# Altium schematic sheet [6] RGBLED.SchDoc: =DocumentName
size A3; ENG_APP_DATE: --/--/--; DSN_APP_DATE: --/--/--; CHK_APP_DATE: --/--/--; Organization: ORGANIZATION; Address1: R. Aprígio Veloso, 882, Universitário; Address2: Campina Grande - PB; Address3: 58429-900; DocumentNumber: 6; Revision: -; SheetNumber: 6; SheetTotal: 9; ENG_DATE: --/--/--; DSN_DATE: --/--/--; CHK_DATE: --/--/--; SCH_SCALE: 1:1
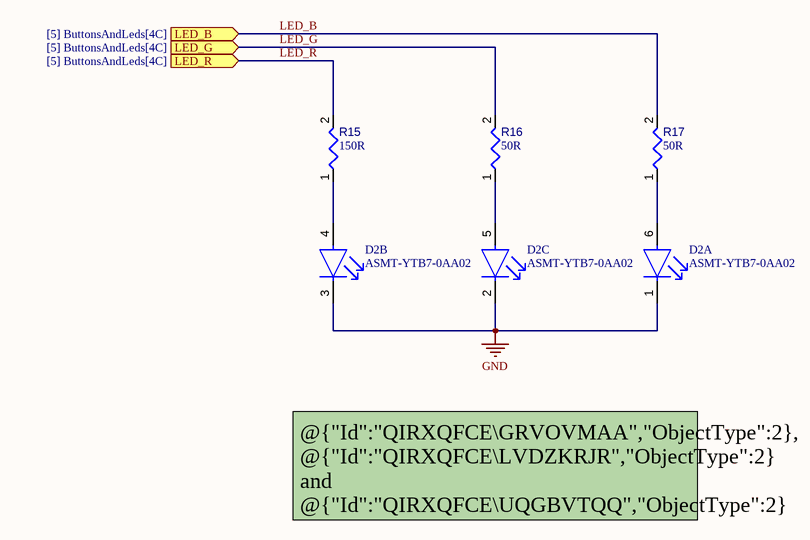
[diagram p0: [6] RGBLED.SchDoc]

## Parts
D2  ASMT-YTB7-0AA02  [FP-PLCC-6-MFG]  (parts A,B,C of 3)
R15  value 150R  [RESC0603(1608)_L]  (hidden comment: CRCW0603150RFKEA)
R16  value 50R  [RESC0603(1608)_L]  (hidden comment: CRCW060350R0FKEA)
R17  value 50R  [RESC0603(1608)_L]  (hidden comment: CRCW060350R0FKEA)

## Ports
LED_B (in, see [5] ButtonsAndLeds[4C]), LED_G (in, see [5] ButtonsAndLeds[4C]), LED_R (in, see [5] ButtonsAndLeds[4C])

## Nets
GND: D2.1(Cathode(Blue)) D2.2(Cathode(Green)) D2.3(Cathode(Red))
LED_B: R17.2 ; port LED_B
LED_G: R16.2 ; port LED_G
LED_R: R15.2 ; port LED_R
NetD2_4: D2.4(Anode(Red)) R15.1
NetD2_5: D2.5(Anode(Green)) R16.1
NetD2_6: D2.6(Anode(Blue)) R17.1

## Notes on the sheet
- @{"Id":"QIRXQFCE\GRVOVMAA","ObjectType":2}, @{"Id":"QIRXQFCE\LVDZKRJR","ObjectType":2} and @{"Id":"QIRXQFCE\UQGBVTQQ","ObjectType":2} calculated based on voltage drops for each LED for a same current amount of 10mA.
- REVISION
- DESCRIPTION
- DATE
- APPROVED
- ADDRESS
- PROJECT
- VERSION
- TITLE
- A3
- SIZE
- SCALE
- DOCUMENT NAME:
- DOCUMENT REVISION:
- OF
- SHEET:
- PROJECT REVISION:

## Library data of the parts
D2 = CMP-007-00036-1: LED Tri-Color Blue/Green/Red 469nm/529nm/623nm Chip LED 6-Pin PLCC T/R; Forward Voltage: 3.1V; Test Current: 20mA; Number of LEDs: 3; Lens Transparency: Diffused; Luminous Intensity: 384mcd; Viewing Angle: 120°; Color: Blue,Green,Red; Reverse Voltage: 4V; Dominant Wavelength: 469nm; Lens Style: Flat,Square,Diffused,Rectangular; Lens Size: 2.3mm; Packaging: Cut Tape; Min Operating Temperature: -40°C; Weight: 40mg; Forward Current: 20mA; Orientation: Top View; Package Quantity: 2000; Case/Package: PLCC; Length: 3mm; Height: 2mm; Max Operating Temperature: 100°C; Contact Plating: Silver; Width: 2.8mm; Reach SVHC Compliant: No; Pins: 6; Series: -; Mounting Technology: Surface Mount
R15 = CMP-009-00179-1: SMD Chip Resistor, 150 Ohm, ± 1%, 100 mW, 0603 [1608 Metric], Thick Film, General Purpose; Voltage Rating (DC): 75V; Power Rating: 100mW; Temperature Coefficient: 100ppm/°C; Reach SVHC Compliant: Unknown; Height: 0.45mm; Package Quantity: 5000; Technology: THICK FILM; Case Code (Metric): 1608; Weight: 7.1E-05oz; Tolerance: 1%; Max Operating Temperature: 155°C; Military Standard: Not; Series: CRCW; Contact Plating: Tin; Number of Terminations: 2; Ratings: AEC-Q200; Features: Automotive AEC-Q200; Packaging: Tape and Reel; Resistor Type: Thick Film; Construction: Rectangular; Lead Free: Lead Free; Termination: SMD/SMT; Min Operating Temperature: -55°C; Max Power Dissipation: 100mW; Voltage Rating: 75V; Case/Package: 0603; Depth: 0.85mm; Width: 0.85mm; Radiation Hardening: No; Length: 1.55mm; Case Code (Imperial): 0603; RoHS Compliant: Yes; Resistance Tolerance: 1%
R16 R17 = CMP-009-00180-1: SMD Chip Resistor, 50 Ohm, ± 1%, 100 mW, 0603 [1608 Metric], Thick Film, General Purpose; Voltage Rating (DC): 75V; Temperature Coefficient: 100ppm/°C; Max Power Dissipation: 100mW; Termination: SMD/SMT; Height: 0.45mm; Features: Automotive AEC-Q200; Package Quantity: 5000; Max Operating Temperature: 155°C; Pins: 2; Resistance Tolerance: 1%; Depth: 0.85mm; Width: 0.85mm; Contact Plating: Tin; RoHS Compliant: Yes; Case Code (Metric): 1608; Length: 1.55mm; Radiation Hardening: No; Resistor Type: Thick Film; Min Operating Temperature: -55°C; Tolerance: 1%; Reach SVHC Compliant: No; Number of Terminations: 2; Weight: 7.1E-05oz; Packaging: Tape and Reel; Power Rating: 100mW; Case Code (Imperial): 0603; Technology: THICK FILM; Voltage Rating: 75V; Lead Free: Lead Free; Series: CRCW; Case/Package: 0603